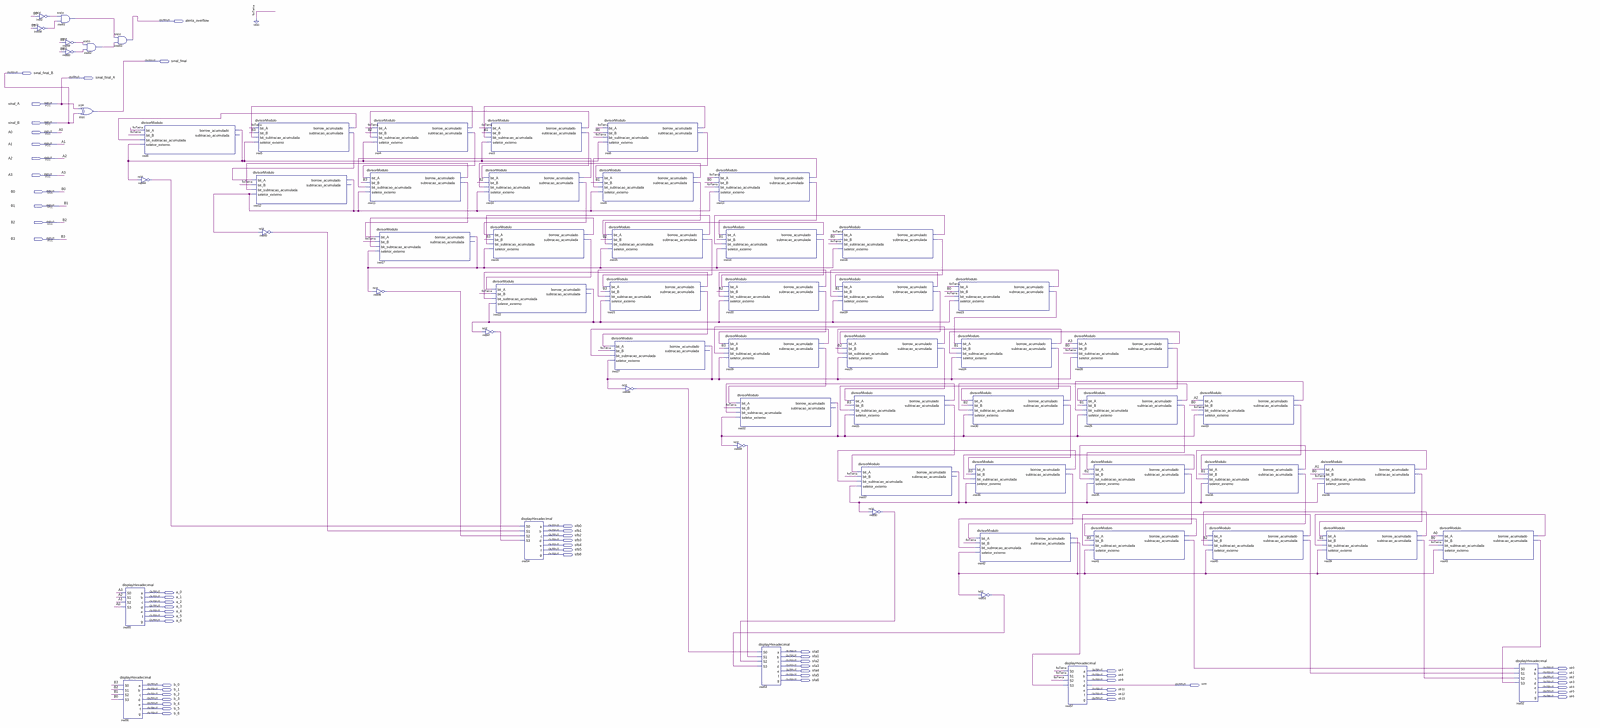
[diagram p0: schematic sheet, whole]
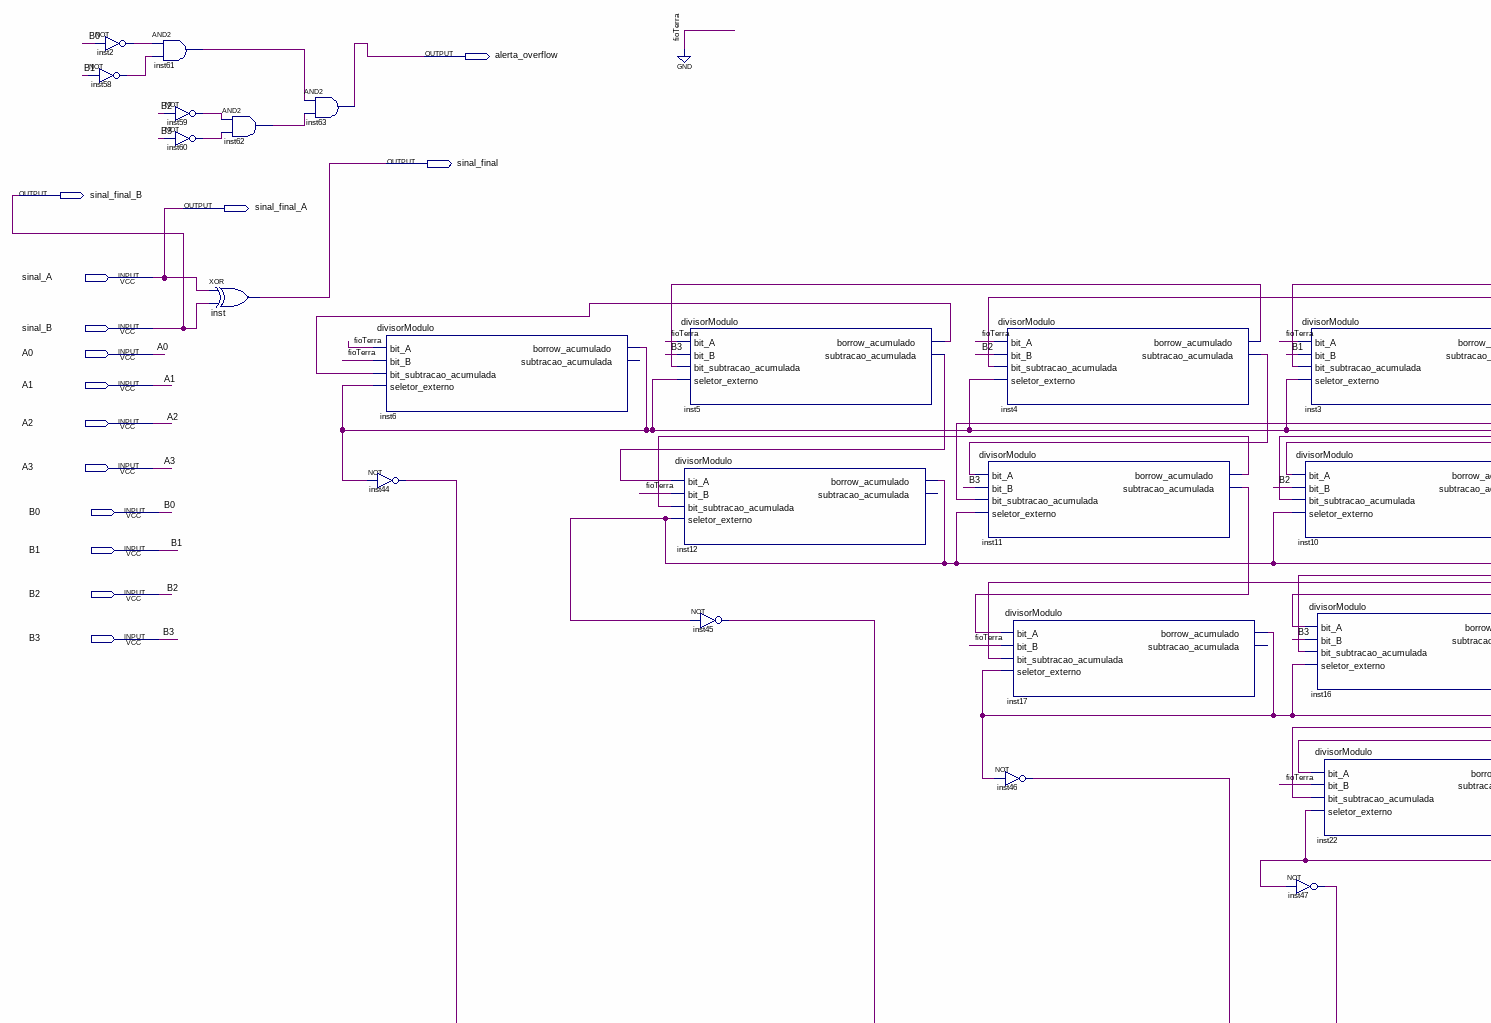
[diagram p1: schematic sheet, upper left part]
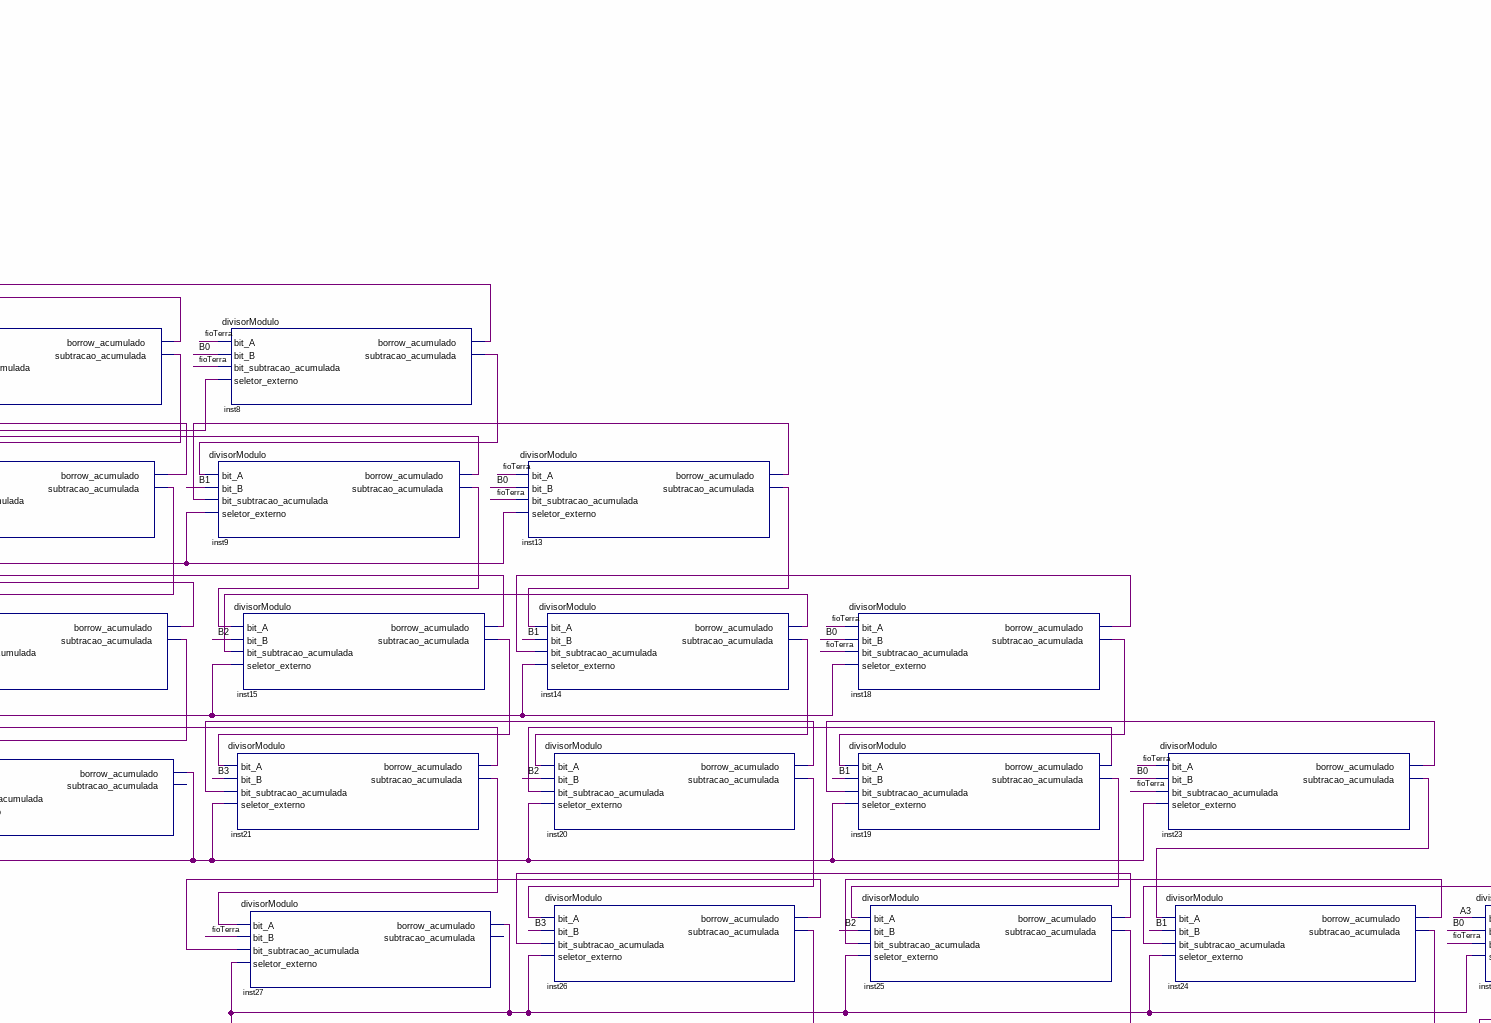
[diagram p2: schematic sheet, upper centre part]
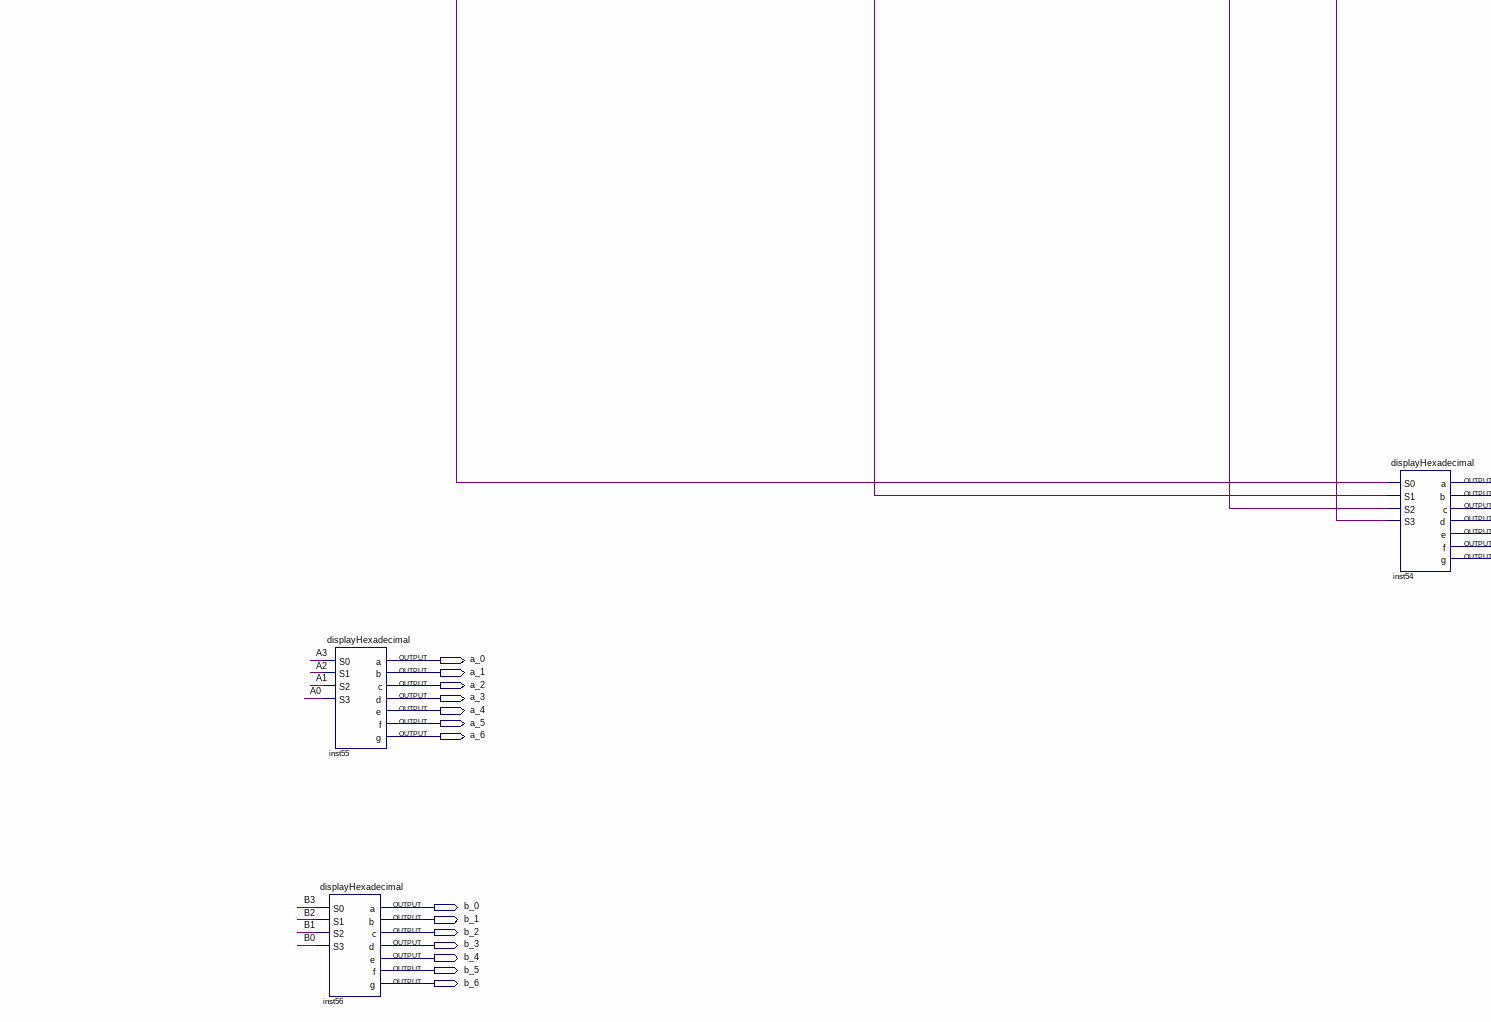
[diagram p3: schematic sheet, lower left part]
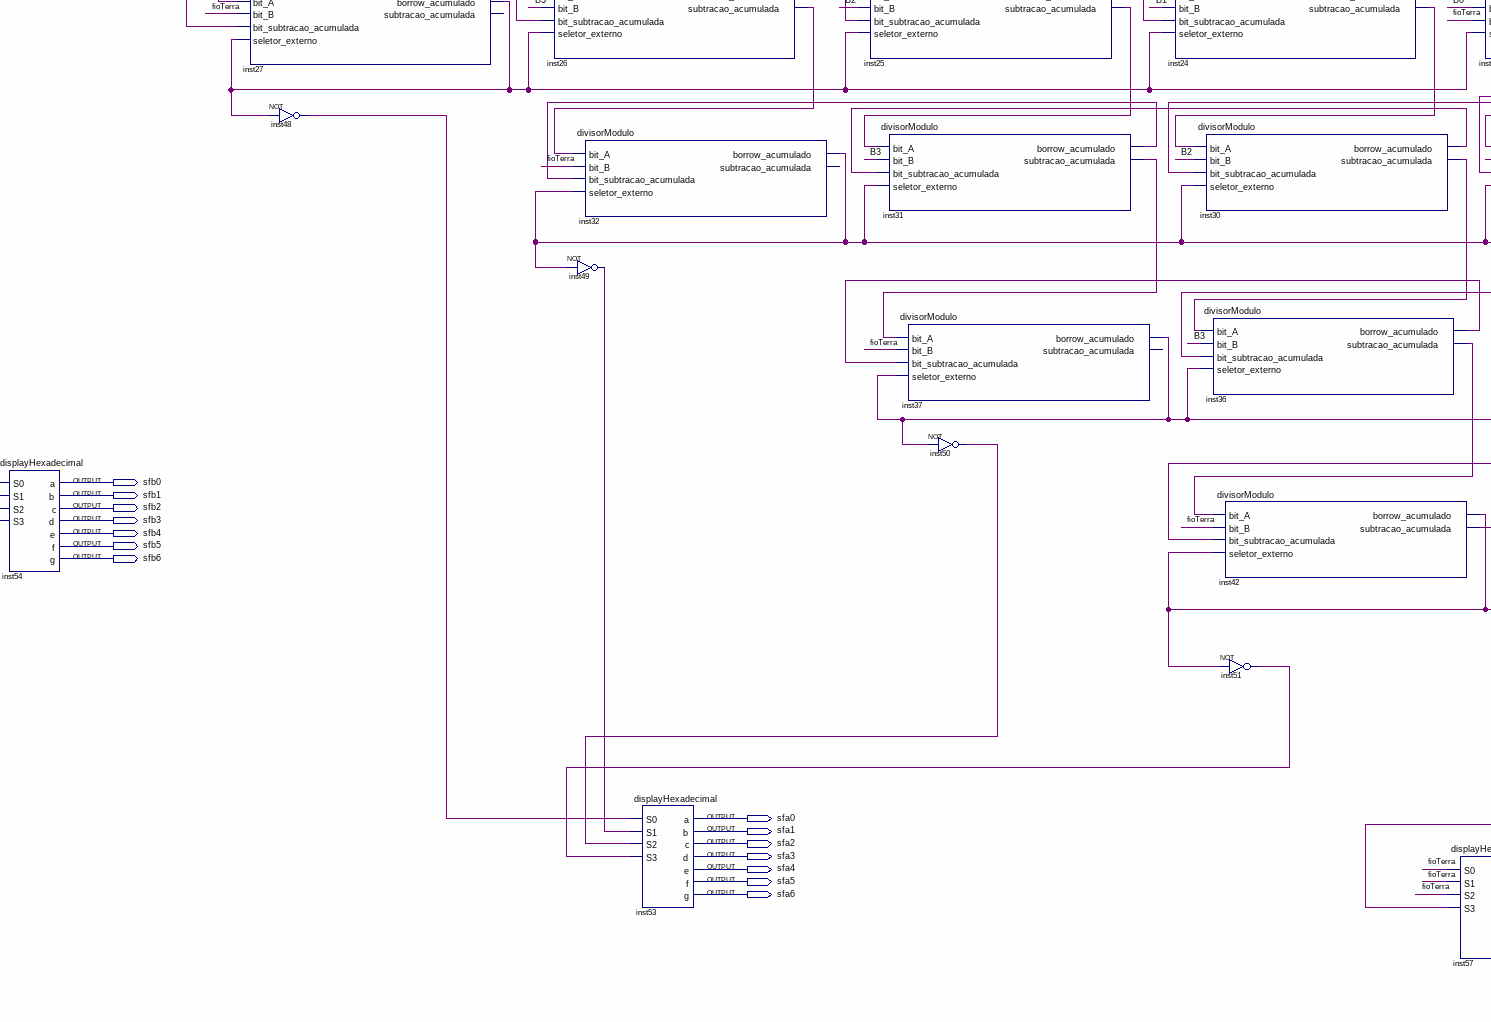
[diagram p4: schematic sheet, lower centre part]
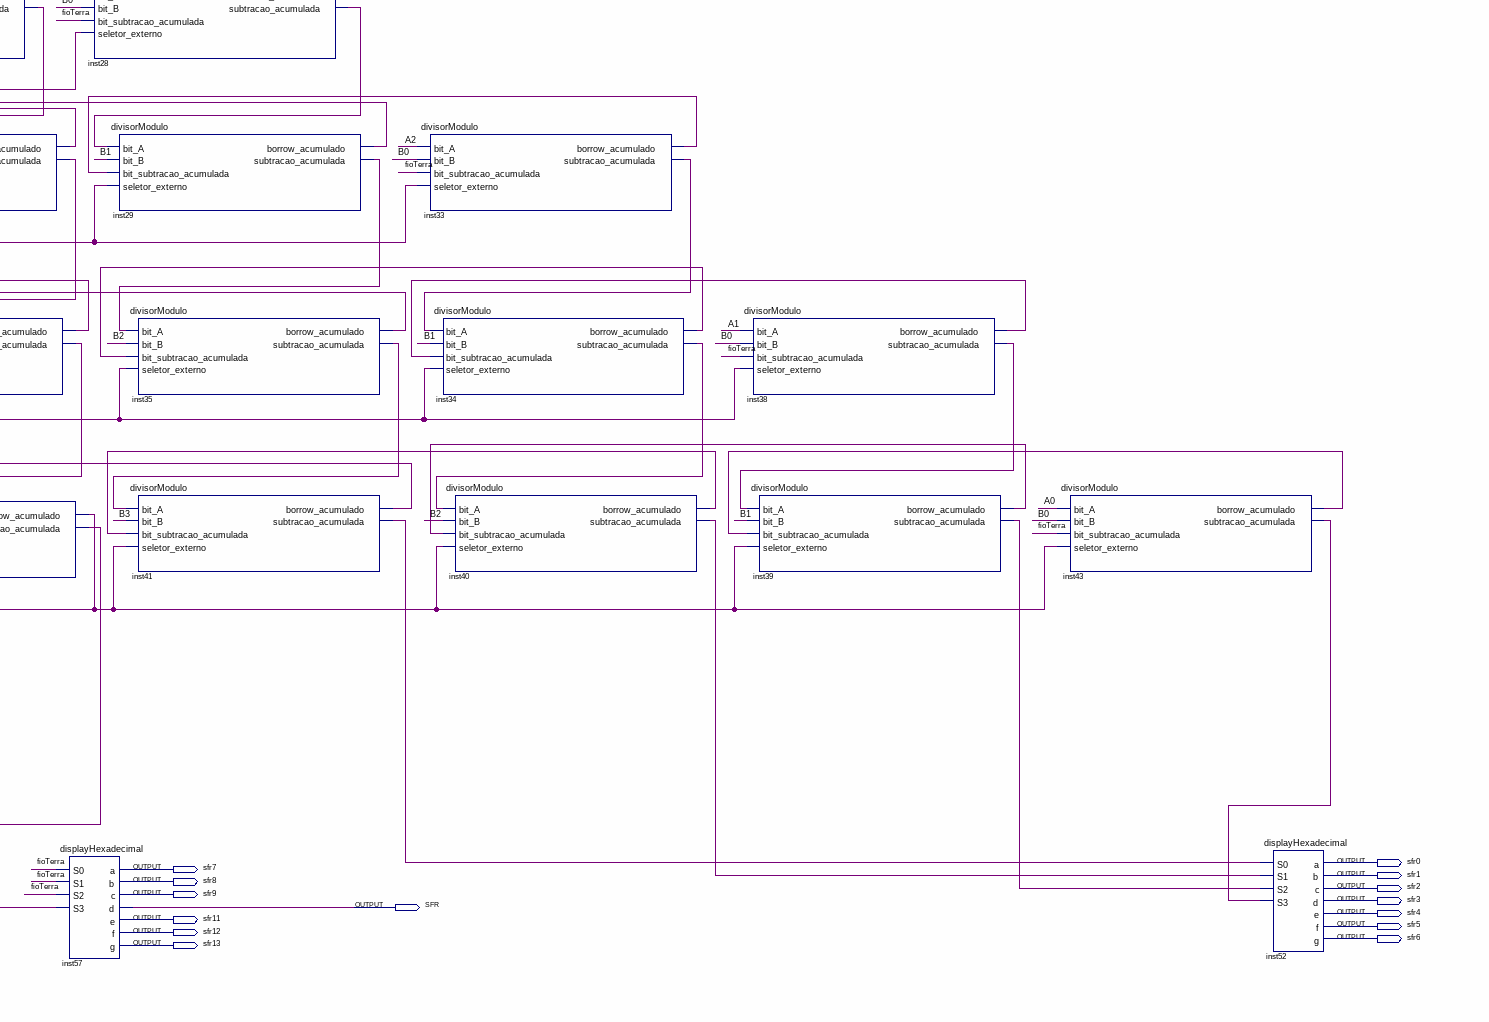
[diagram p5: schematic sheet, lower right part]
// Quartus schematic aula11.bdf as structural Verilog: 62 symbols, 56 pins
module aula11 (
  input  sinal_A,
  input  sinal_B,
  input  A0,
  input  A1,
  input  A2,
  input  A3,
  input  B0,
  input  B1,
  input  B2,
  input  B3,
  output alerta_overflow,
  output sinal_final,
  output sinal_final_B,
  output sinal_final_A,
  output sfb0,
  output sfb1,
  output sfb2,
  output sfb3,
  output sfb4,
  output sfb5,
  output sfb6,
  output a_0,
  output a_1,
  output a_2,
  output a_3,
  output a_4,
  output a_5,
  output a_6,
  output sfa0,
  output sfa1,
  output sfa2,
  output sfa3,
  output sfr0,
  output sfa4,
  output sfr7,
  output sfr1,
  output sfa5,
  output sfr8,
  output sfr2,
  output sfa6,
  output sfr9,
  output sfr3,
  output b_0,
  output SFR,
  output sfr4,
  output b_1,
  output sfr11,
  output sfr5,
  output b_2,
  output sfr12,
  output sfr6,
  output b_3,
  output sfr13,
  output b_4,
  output b_5,
  output b_6
);

  wire inst2_out, inst3_borrow_acumulado, inst3_subtracao_acumulada, inst4_borrow_acumulado,
       inst4_subtracao_acumulada, inst5_borrow_acumulado, inst5_subtracao_acumulada, inst6_borrow_acumulado,
       inst8_borrow_acumulado, inst8_subtracao_acumulada, inst9_borrow_acumulado, inst9_subtracao_acumulada,
       inst10_borrow_acumulado, inst10_subtracao_acumulada, inst11_borrow_acumulado,
       inst11_subtracao_acumulada, inst12_borrow_acumulado, inst13_borrow_acumulado,
       inst13_subtracao_acumulada, inst14_borrow_acumulado, inst14_subtracao_acumulada,
       inst15_borrow_acumulado, inst15_subtracao_acumulada, inst16_borrow_acumulado,
       inst16_subtracao_acumulada, inst17_borrow_acumulado, inst18_borrow_acumulado,
       inst18_subtracao_acumulada, inst19_borrow_acumulado, inst19_subtracao_acumulada,
       inst20_borrow_acumulado, inst20_subtracao_acumulada, inst21_borrow_acumulado,
       inst21_subtracao_acumulada, inst22_borrow_acumulado, inst23_borrow_acumulado,
       inst23_subtracao_acumulada, inst24_borrow_acumulado, inst24_subtracao_acumulada,
       inst25_borrow_acumulado, inst25_subtracao_acumulada, inst26_borrow_acumulado,
       inst26_subtracao_acumulada, inst27_borrow_acumulado, inst28_borrow_acumulado,
       inst28_subtracao_acumulada, inst29_borrow_acumulado, inst29_subtracao_acumulada,
       inst30_borrow_acumulado, inst30_subtracao_acumulada, inst31_borrow_acumulado,
       inst31_subtracao_acumulada, inst32_borrow_acumulado, inst33_borrow_acumulado,
       inst33_subtracao_acumulada, inst34_borrow_acumulado, inst34_subtracao_acumulada,
       inst35_borrow_acumulado, inst35_subtracao_acumulada, inst36_borrow_acumulado,
       inst36_subtracao_acumulada, inst37_borrow_acumulado, inst38_borrow_acumulado,
       inst38_subtracao_acumulada, inst39_borrow_acumulado, inst39_subtracao_acumulada,
       inst40_borrow_acumulado, inst40_subtracao_acumulada, inst41_borrow_acumulado,
       inst41_subtracao_acumulada, inst42_borrow_acumulado, inst42_subtracao_acumulada,
       inst43_borrow_acumulado, inst43_subtracao_acumulada, inst44_out, inst45_out, inst46_out, inst47_out,
       inst48_out, inst49_out, inst50_out, inst51_out, inst58_out, inst59_out, inst60_out, inst61_out,
       inst62_out;

  not inst2 (inst2_out, B0);
  not inst58 (inst58_out, B1);
  and inst61 (inst61_out, inst2_out, inst58_out);
  not inst59 (inst59_out, B2);
  not inst60 (inst60_out, B3);
  and inst62 (inst62_out, inst59_out, inst60_out);
  xor inst (sinal_final, sinal_A, sinal_B);
  and inst63 (alerta_overflow, inst61_out, inst62_out);
  displayHexadecimal inst55 (
    .S0(A3), .S1(A2), .S2(A1), .S3(A0), .a(a_0), .b(a_1), .c(a_2), .d(a_3), .e(a_4), .f(a_5), .g(a_6));
  displayHexadecimal inst56 (
    .S0(B3), .S1(B2), .S2(B1), .S3(B0), .a(b_0), .b(b_1), .c(b_2), .d(b_3), .e(b_4), .f(b_5), .g(b_6));
  divisorModulo inst6 (
    .bit_A(1'b0), .bit_B(1'b0), .bit_subtracao_acumulada(inst5_borrow_acumulado),
    .seletor_externo(inst6_borrow_acumulado), .borrow_acumulado(inst6_borrow_acumulado));  // open: subtracao_acumulada
  not inst44 (inst44_out, inst6_borrow_acumulado);
  divisorModulo inst5 (
    .bit_A(1'b0), .bit_B(B3), .bit_subtracao_acumulada(inst4_borrow_acumulado),
    .seletor_externo(inst6_borrow_acumulado), .borrow_acumulado(inst5_borrow_acumulado),
    .subtracao_acumulada(inst5_subtracao_acumulada));
  divisorModulo inst12 (
    .bit_A(inst5_subtracao_acumulada), .bit_B(1'b0), .bit_subtracao_acumulada(inst11_borrow_acumulado),
    .seletor_externo(inst12_borrow_acumulado), .borrow_acumulado(inst12_borrow_acumulado));  // open: subtracao_acumulada
  not inst45 (inst45_out, inst12_borrow_acumulado);
  divisorModulo inst11 (
    .bit_A(inst4_subtracao_acumulada), .bit_B(B3), .bit_subtracao_acumulada(inst10_borrow_acumulado),
    .seletor_externo(inst12_borrow_acumulado), .borrow_acumulado(inst11_borrow_acumulado),
    .subtracao_acumulada(inst11_subtracao_acumulada));
  divisorModulo inst4 (
    .bit_A(1'b0), .bit_B(B2), .bit_subtracao_acumulada(inst3_borrow_acumulado),
    .seletor_externo(inst6_borrow_acumulado), .borrow_acumulado(inst4_borrow_acumulado),
    .subtracao_acumulada(inst4_subtracao_acumulada));
  divisorModulo inst17 (
    .bit_A(inst11_subtracao_acumulada), .bit_B(1'b0), .bit_subtracao_acumulada(inst16_borrow_acumulado),
    .seletor_externo(inst17_borrow_acumulado), .borrow_acumulado(inst17_borrow_acumulado));  // open: subtracao_acumulada
  not inst46 (inst46_out, inst17_borrow_acumulado);
  divisorModulo inst10 (
    .bit_A(inst3_subtracao_acumulada), .bit_B(B2), .bit_subtracao_acumulada(inst9_borrow_acumulado),
    .seletor_externo(inst12_borrow_acumulado), .borrow_acumulado(inst10_borrow_acumulado),
    .subtracao_acumulada(inst10_subtracao_acumulada));
  not inst47 (inst47_out, inst22_borrow_acumulado);
  divisorModulo inst3 (
    .bit_A(1'b0), .bit_B(B1), .bit_subtracao_acumulada(inst8_borrow_acumulado),
    .seletor_externo(inst6_borrow_acumulado), .borrow_acumulado(inst3_borrow_acumulado),
    .subtracao_acumulada(inst3_subtracao_acumulada));
  divisorModulo inst16 (
    .bit_A(inst10_subtracao_acumulada), .bit_B(B3), .bit_subtracao_acumulada(inst15_borrow_acumulado),
    .seletor_externo(inst17_borrow_acumulado), .borrow_acumulado(inst16_borrow_acumulado),
    .subtracao_acumulada(inst16_subtracao_acumulada));
  divisorModulo inst22 (
    .bit_A(inst16_subtracao_acumulada), .bit_B(1'b0), .bit_subtracao_acumulada(inst21_borrow_acumulado),
    .seletor_externo(inst22_borrow_acumulado), .borrow_acumulado(inst22_borrow_acumulado));  // open: subtracao_acumulada
  displayHexadecimal inst54 (
    .S0(inst44_out), .S1(inst45_out), .S2(inst46_out), .S3(inst47_out), .a(sfb0), .b(sfb1), .c(sfb2),
    .d(sfb3), .e(sfb4), .f(sfb5), .g(sfb6));
  divisorModulo inst9 (
    .bit_A(inst8_subtracao_acumulada), .bit_B(B1), .bit_subtracao_acumulada(inst13_borrow_acumulado),
    .seletor_externo(inst12_borrow_acumulado), .borrow_acumulado(inst9_borrow_acumulado),
    .subtracao_acumulada(inst9_subtracao_acumulada));
  divisorModulo inst8 (
    .bit_A(1'b0), .bit_B(B0), .bit_subtracao_acumulada(1'b0), .seletor_externo(inst6_borrow_acumulado),
    .borrow_acumulado(inst8_borrow_acumulado), .subtracao_acumulada(inst8_subtracao_acumulada));
  divisorModulo inst15 (
    .bit_A(inst9_subtracao_acumulada), .bit_B(B2), .bit_subtracao_acumulada(inst14_borrow_acumulado),
    .seletor_externo(inst17_borrow_acumulado), .borrow_acumulado(inst15_borrow_acumulado),
    .subtracao_acumulada(inst15_subtracao_acumulada));
  divisorModulo inst21 (
    .bit_A(inst15_subtracao_acumulada), .bit_B(B3), .bit_subtracao_acumulada(inst20_borrow_acumulado),
    .seletor_externo(inst22_borrow_acumulado), .borrow_acumulado(inst21_borrow_acumulado),
    .subtracao_acumulada(inst21_subtracao_acumulada));
  divisorModulo inst27 (
    .bit_A(inst21_subtracao_acumulada), .bit_B(1'b0), .bit_subtracao_acumulada(inst26_borrow_acumulado),
    .seletor_externo(inst27_borrow_acumulado), .borrow_acumulado(inst27_borrow_acumulado));  // open: subtracao_acumulada
  not inst48 (inst48_out, inst27_borrow_acumulado);
  divisorModulo inst13 (
    .bit_A(1'b0), .bit_B(B0), .bit_subtracao_acumulada(1'b0), .seletor_externo(inst12_borrow_acumulado),
    .borrow_acumulado(inst13_borrow_acumulado), .subtracao_acumulada(inst13_subtracao_acumulada));
  divisorModulo inst14 (
    .bit_A(inst13_subtracao_acumulada), .bit_B(B1), .bit_subtracao_acumulada(inst18_borrow_acumulado),
    .seletor_externo(inst17_borrow_acumulado), .borrow_acumulado(inst14_borrow_acumulado),
    .subtracao_acumulada(inst14_subtracao_acumulada));
  divisorModulo inst20 (
    .bit_A(inst14_subtracao_acumulada), .bit_B(B2), .bit_subtracao_acumulada(inst19_borrow_acumulado),
    .seletor_externo(inst22_borrow_acumulado), .borrow_acumulado(inst20_borrow_acumulado),
    .subtracao_acumulada(inst20_subtracao_acumulada));
  divisorModulo inst26 (
    .bit_A(inst20_subtracao_acumulada), .bit_B(B3), .bit_subtracao_acumulada(inst25_borrow_acumulado),
    .seletor_externo(inst27_borrow_acumulado), .borrow_acumulado(inst26_borrow_acumulado),
    .subtracao_acumulada(inst26_subtracao_acumulada));
  divisorModulo inst32 (
    .bit_A(inst26_subtracao_acumulada), .bit_B(1'b0), .bit_subtracao_acumulada(inst31_borrow_acumulado),
    .seletor_externo(inst32_borrow_acumulado), .borrow_acumulado(inst32_borrow_acumulado));  // open: subtracao_acumulada
  not inst49 (inst49_out, inst32_borrow_acumulado);
  displayHexadecimal inst53 (
    .S0(inst48_out), .S1(inst49_out), .S2(inst50_out), .S3(inst51_out), .a(sfa0), .b(sfa1), .c(sfa2),
    .d(sfa3), .e(sfa4), .f(sfa5), .g(sfa6));
  divisorModulo inst18 (
    .bit_A(1'b0), .bit_B(B0), .bit_subtracao_acumulada(1'b0), .seletor_externo(inst17_borrow_acumulado),
    .borrow_acumulado(inst18_borrow_acumulado), .subtracao_acumulada(inst18_subtracao_acumulada));
  divisorModulo inst19 (
    .bit_A(inst18_subtracao_acumulada), .bit_B(B1), .bit_subtracao_acumulada(inst23_borrow_acumulado),
    .seletor_externo(inst22_borrow_acumulado), .borrow_acumulado(inst19_borrow_acumulado),
    .subtracao_acumulada(inst19_subtracao_acumulada));
  divisorModulo inst25 (
    .bit_A(inst19_subtracao_acumulada), .bit_B(B2), .bit_subtracao_acumulada(inst24_borrow_acumulado),
    .seletor_externo(inst27_borrow_acumulado), .borrow_acumulado(inst25_borrow_acumulado),
    .subtracao_acumulada(inst25_subtracao_acumulada));
  divisorModulo inst31 (
    .bit_A(inst25_subtracao_acumulada), .bit_B(B3), .bit_subtracao_acumulada(inst30_borrow_acumulado),
    .seletor_externo(inst32_borrow_acumulado), .borrow_acumulado(inst31_borrow_acumulado),
    .subtracao_acumulada(inst31_subtracao_acumulada));
  divisorModulo inst37 (
    .bit_A(inst31_subtracao_acumulada), .bit_B(1'b0), .bit_subtracao_acumulada(inst36_borrow_acumulado),
    .seletor_externo(inst37_borrow_acumulado), .borrow_acumulado(inst37_borrow_acumulado));  // open: subtracao_acumulada
  not inst50 (inst50_out, inst37_borrow_acumulado);
  divisorModulo inst23 (
    .bit_A(1'b0), .bit_B(B0), .bit_subtracao_acumulada(1'b0), .seletor_externo(inst22_borrow_acumulado),
    .borrow_acumulado(inst23_borrow_acumulado), .subtracao_acumulada(inst23_subtracao_acumulada));
  divisorModulo inst24 (
    .bit_A(inst23_subtracao_acumulada), .bit_B(B1), .bit_subtracao_acumulada(inst28_borrow_acumulado),
    .seletor_externo(inst27_borrow_acumulado), .borrow_acumulado(inst24_borrow_acumulado),
    .subtracao_acumulada(inst24_subtracao_acumulada));
  divisorModulo inst30 (
    .bit_A(inst24_subtracao_acumulada), .bit_B(B2), .bit_subtracao_acumulada(inst29_borrow_acumulado),
    .seletor_externo(inst32_borrow_acumulado), .borrow_acumulado(inst30_borrow_acumulado),
    .subtracao_acumulada(inst30_subtracao_acumulada));
  divisorModulo inst36 (
    .bit_A(inst30_subtracao_acumulada), .bit_B(B3), .bit_subtracao_acumulada(inst35_borrow_acumulado),
    .seletor_externo(inst37_borrow_acumulado), .borrow_acumulado(inst36_borrow_acumulado),
    .subtracao_acumulada(inst36_subtracao_acumulada));
  divisorModulo inst42 (
    .bit_A(inst36_subtracao_acumulada), .bit_B(1'b0), .bit_subtracao_acumulada(inst41_borrow_acumulado),
    .seletor_externo(inst42_borrow_acumulado), .borrow_acumulado(inst42_borrow_acumulado),
    .subtracao_acumulada(inst42_subtracao_acumulada));
  not inst51 (inst51_out, inst42_borrow_acumulado);
  divisorModulo inst28 (
    .bit_A(A3), .bit_B(B0), .bit_subtracao_acumulada(1'b0), .seletor_externo(inst27_borrow_acumulado),
    .borrow_acumulado(inst28_borrow_acumulado), .subtracao_acumulada(inst28_subtracao_acumulada));
  displayHexadecimal inst57 (
    .S0(1'b0), .S1(1'b0), .S2(1'b0), .S3(inst42_subtracao_acumulada), .a(sfr7), .b(sfr8), .c(sfr9), .d(SFR),
    .e(sfr11), .f(sfr12), .g(sfr13));
  divisorModulo inst29 (
    .bit_A(inst28_subtracao_acumulada), .bit_B(B1), .bit_subtracao_acumulada(inst33_borrow_acumulado),
    .seletor_externo(inst32_borrow_acumulado), .borrow_acumulado(inst29_borrow_acumulado),
    .subtracao_acumulada(inst29_subtracao_acumulada));
  divisorModulo inst35 (
    .bit_A(inst29_subtracao_acumulada), .bit_B(B2), .bit_subtracao_acumulada(inst34_borrow_acumulado),
    .seletor_externo(inst37_borrow_acumulado), .borrow_acumulado(inst35_borrow_acumulado),
    .subtracao_acumulada(inst35_subtracao_acumulada));
  divisorModulo inst41 (
    .bit_A(inst35_subtracao_acumulada), .bit_B(B3), .bit_subtracao_acumulada(inst40_borrow_acumulado),
    .seletor_externo(inst42_borrow_acumulado), .borrow_acumulado(inst41_borrow_acumulado),
    .subtracao_acumulada(inst41_subtracao_acumulada));
  divisorModulo inst33 (
    .bit_A(A2), .bit_B(B0), .bit_subtracao_acumulada(1'b0), .seletor_externo(inst32_borrow_acumulado),
    .borrow_acumulado(inst33_borrow_acumulado), .subtracao_acumulada(inst33_subtracao_acumulada));
  divisorModulo inst34 (
    .bit_A(inst33_subtracao_acumulada), .bit_B(B1), .bit_subtracao_acumulada(inst38_borrow_acumulado),
    .seletor_externo(inst37_borrow_acumulado), .borrow_acumulado(inst34_borrow_acumulado),
    .subtracao_acumulada(inst34_subtracao_acumulada));
  divisorModulo inst40 (
    .bit_A(inst34_subtracao_acumulada), .bit_B(B2), .bit_subtracao_acumulada(inst39_borrow_acumulado),
    .seletor_externo(inst42_borrow_acumulado), .borrow_acumulado(inst40_borrow_acumulado),
    .subtracao_acumulada(inst40_subtracao_acumulada));
  divisorModulo inst38 (
    .bit_A(A1), .bit_B(B0), .bit_subtracao_acumulada(1'b0), .seletor_externo(inst37_borrow_acumulado),
    .borrow_acumulado(inst38_borrow_acumulado), .subtracao_acumulada(inst38_subtracao_acumulada));
  divisorModulo inst39 (
    .bit_A(inst38_subtracao_acumulada), .bit_B(B1), .bit_subtracao_acumulada(inst43_borrow_acumulado),
    .seletor_externo(inst42_borrow_acumulado), .borrow_acumulado(inst39_borrow_acumulado),
    .subtracao_acumulada(inst39_subtracao_acumulada));
  divisorModulo inst43 (
    .bit_A(A0), .bit_B(B0), .bit_subtracao_acumulada(1'b0), .seletor_externo(inst42_borrow_acumulado),
    .borrow_acumulado(inst43_borrow_acumulado), .subtracao_acumulada(inst43_subtracao_acumulada));
  displayHexadecimal inst52 (
    .S0(inst41_subtracao_acumulada), .S1(inst40_subtracao_acumulada), .S2(inst39_subtracao_acumulada),
    .S3(inst43_subtracao_acumulada), .a(sfr0), .b(sfr1), .c(sfr2), .d(sfr3), .e(sfr4), .f(sfr5), .g(sfr6));

  assign sinal_final_A = sinal_A;
  assign sinal_final_B = sinal_B;
endmodule
